# Altium schematic sheet esquematicobluepill.SchDoc (part 1 of 3)
size A4; SheetNumber: 1; SheetTotal: 2
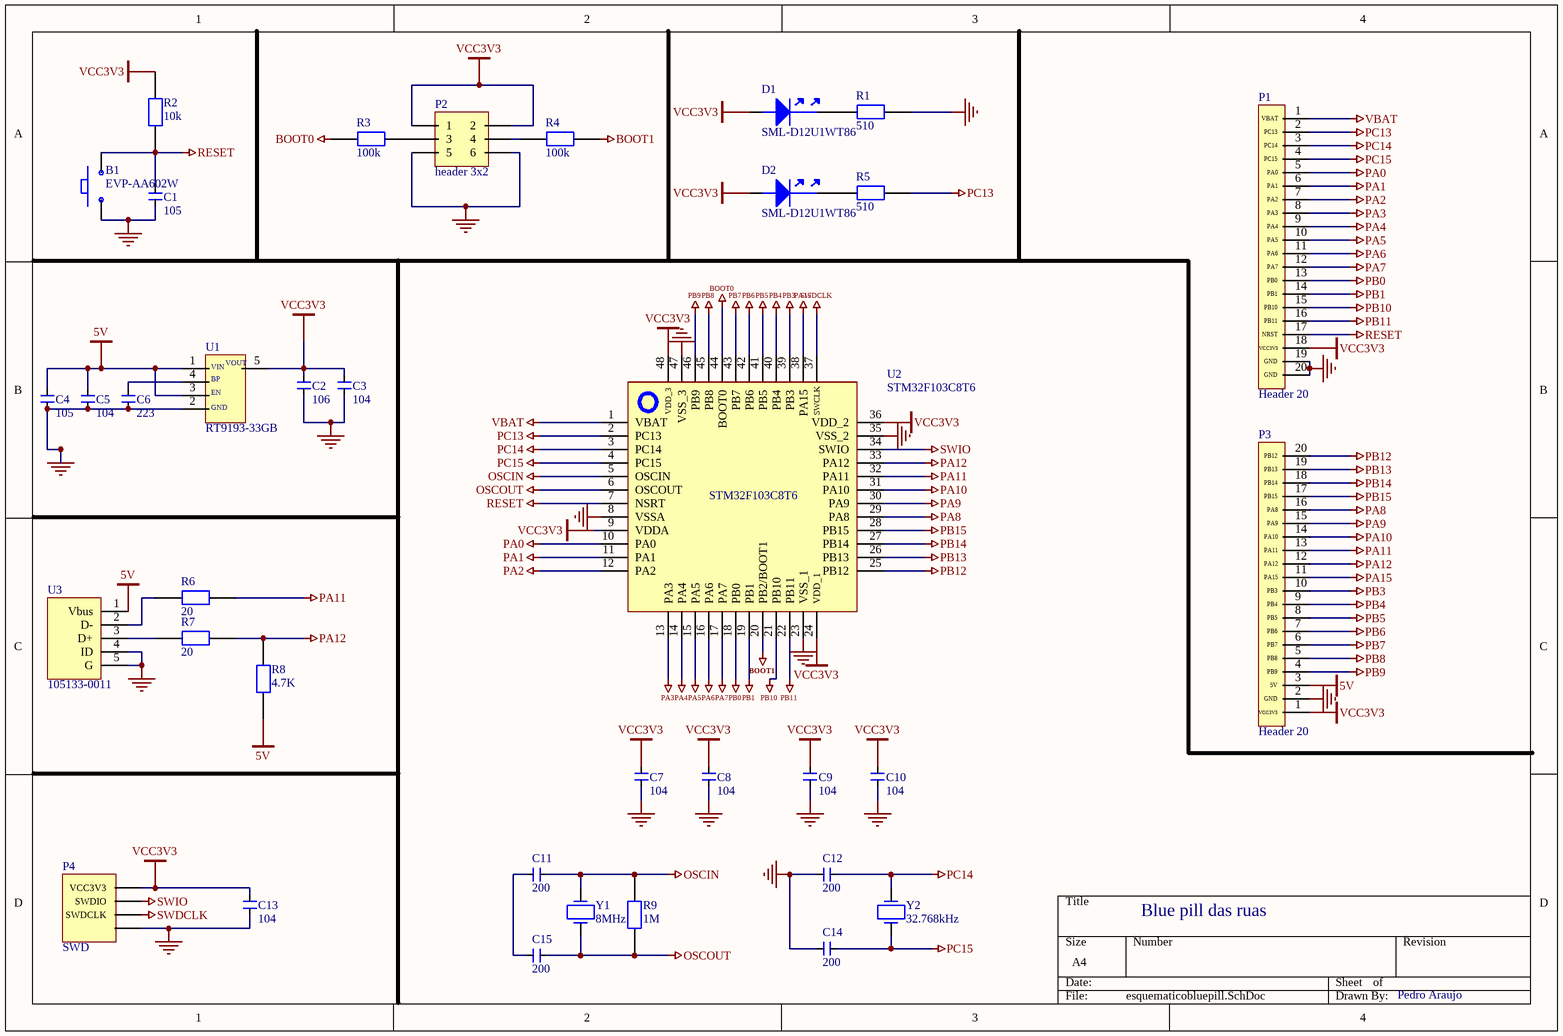
[diagram p0: esquematicobluepill.SchDoc]

## Parts
B1  EVP-AA602W  [botao]
C1  105  [C_1µF_10V]
C2  106  [C_10µF_10V]
C3  104  [C_0603_0.1uF_10V]
C4  105  [C_1µF_10V]
C5  104  [C_0603_0.1uF_10V]
C6  223  [C_0.022 µF_10V]
C7  104  [C_0603_0.1uF_10V]
C8  104  [C_0603_0.1uF_10V]
C9  104  [C_0603_0.1uF_10V]
C10  104  [C_0603_0.1uF_10V]
C11  200  [C_20pF_50V]
C12  200  [C_20pF_50V]
C13  104  [C_0603_0.1uF_10V]
C14  200  [C_20pF_50V]
C15  200  [C_20pF_50V]
D1  SML-D12U1WT86  [Led_0603_red]
D2  SML-D12U1WT86  [Led_0603_red]
P1  Header 20  [20pin]
P2  header 3x2  [HEADER3X2]
P3  Header 20  [20pin]
P4  SWD  [22-05-2041]
R1  510  [R_0603_510]
R2  10k  [R_0603_10K]
R3  100k  [R_0603_100K]
R4  100k  [R_0603_100K]
R5  510  [R_0603_510]
R6  20  [R_0603_20]
R7  20  [R_0603_20]
R8  4.7K  [R_0603_4.7K]
R9  1M  [R_0603_1M]
U1  RT9193-33GB  [SOT94P279X129-5N]
U2  STM32F103C8T6  [STM32F103C8T6]
U3  105133-0011  [usb]
Y1  8MHz  [CRYSTAL_8MHZ]
Y2  32.768kHz  [CRYSTAL_32.7680kHz]

## Nets
5V: C4.1 C5.1 P3.3(5V) R8.2 U1.1 U1.3 U3.1(Vbus)
BOOT0: R3.1 U2.44(BOOT0)
BOOT1: R4.2 U2.20(PB2/BOOT1)
GND: B1.2 C1.2 C2.2 C3.2 C4.2 C5.2 C6.2 C7.2 C8.2 C9.2 C10.2 C12.1 C13.2 C14.1 P1.19(GND) P1.20(GND) P2.5 P2.6 P3.2(GND) P4.4 R1.2 U1.2 U2.8(VSSA) U2.23(VSS_1) U2.35(VSS_2) U2.47(VSS_3) U3.4(ID) U3.5(G)
OSCIN: C11.2 R9.2 U2.5(OSCIN) Y1.1
OSCOUT: C15.2 R9.1 U2.6(OSCOUT) Y1.2
PA0: P1.5(PA0) U2.10(PA0)
PA1: P1.6(PA1) U2.11(PA1)
PA2: P1.7(PA2) U2.12(PA2)
PA3: P1.8(PA3) U2.13(PA3)
PA4: P1.9(PA4) U2.14(PA4)
PA5: P1.10(PA5) U2.15(PA5)
PA6: P1.11(PA6) U2.16(PA6)
PA7: P1.12(PA7) U2.17(PA7)
PA8: P3.16(PA8) U2.29(PA8)
PA9: P3.15(PA9) U2.30(PA9)
PA10: P3.14(PA10) U2.31(PA10)
PA11: P3.13(PA11) R6.2 U2.32(PA11)
PA12: P3.12(PA12) R7.2 R8.1 U2.33(PA12)
PA15: P3.11(PA15) U2.38(PA15)
PB0: P1.13(PB0) U2.18(PB0)
PB1: P1.14(PB1) U2.19(PB1)
PB3: P3.10(PB3) U2.39(PB3)
PB4: P3.9(PB4) U2.40(PB4)
PB5: P3.8(PB5) U2.41(PB5)
PB6: P3.7(PB6) U2.42(PB6)
PB7: P3.6(PB7) U2.43(PB7)
PB8: P3.5(PB8) U2.45(PB8)
PB9: P3.4(PB9) U2.46(PB9)
PB10: P1.15(PB10) U2.21(PB10)
PB11: P1.16(PB11) U2.22(PB11)
PB12: P3.20(PB12) U2.25(PB12)
PB13: P3.19(PB13) U2.26(PB13)
PB14: P3.18(PB14) U2.27(PB14)
PB15: P3.17(PB15) U2.28(PB15)
PC13: P1.2(PC13) R5.2 U2.2(PC13)
PC14: C12.2 P1.3(PC14) U2.3(PC14) Y2.1
PC15: C14.2 P1.4(PC15) U2.4(PC15) Y2.2
RESET: B1.1 C1.1 P1.17(NRST) R2.1 U2.7(NSRT)
SWDCLK: P4.3(SWDCLK) U2.37(SWCLK)
SWIO: P4.2(SWDIO) U2.34(SWIO)
VBAT: P1.1(VBAT) U2.1(VBAT)
VCC3V3: C2.1 C3.1 C7.1 C8.1 C9.1 C10.1 C13.1 D1.2 D2.2 P1.18(VCC3V3) P2.1 P2.2 P3.1(VCC3V3) P4.1(VCC3V3) R2.2 U1.5 U2.9(VDDA) U2.24(VDD_1) U2.36(VDD_2) U2.48(VDD_3)
NetC6_1: C6.1 U1.4
NetC11_1: C11.1 C15.1
NetD1_1: D1.1 R1.1
NetD2_1: D2.1 R5.1
NetP2_3: P2.3 R3.2
NetP2_4: P2.4 R4.1
NetR6_1: R6.1 U3.2(D-)
NetR7_1: R7.1 U3.3(D+)

## Notes on the sheet
- Blue pill das ruas
- Pedro Araujo
- (in symbol RT9193-33GB) VIN; VOUT; BP; EN; GND